# EasyEDA Pro project bldc_driver.eprj

# Schematic Schematic1

## Sheets
1 power_drivers: Board Name: Board1; Create Date: 2025-12-07; Page Name: power_drivers; Project Name: bldc_driver; Schematic Name: Schematic1; Update Date: 2025-12-07; Company: EasyEDA.com; Page Size: A4; Version: V1.0
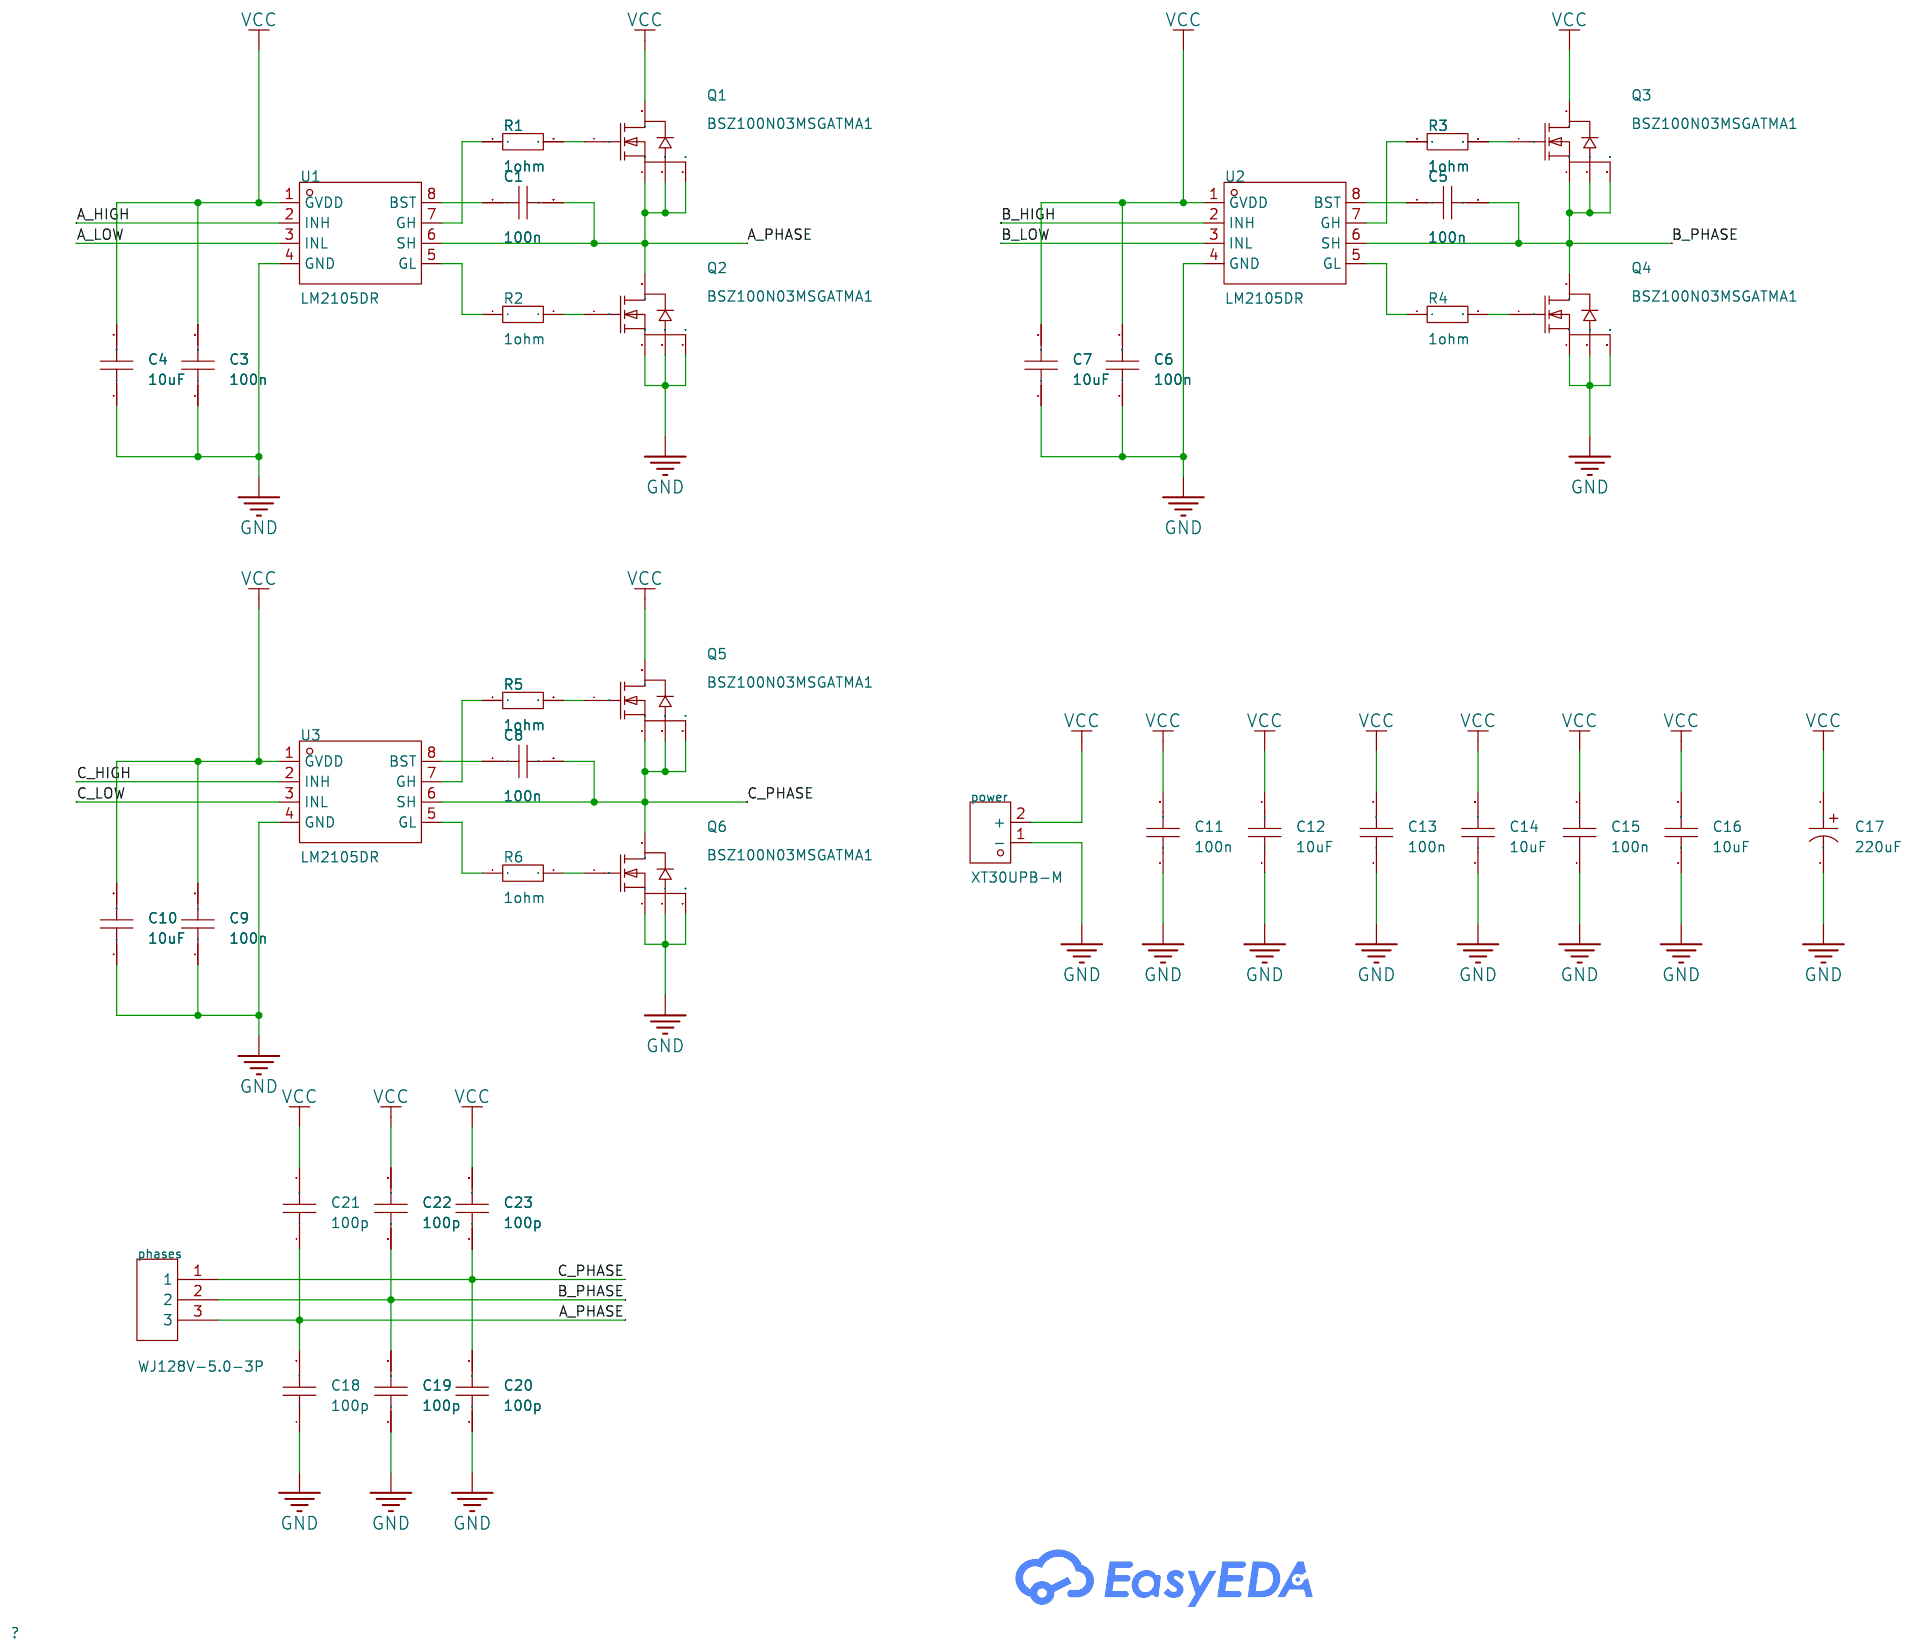
[diagram p0: power_drivers]
2 main: Page Name: main; Update Date: 2025-12-12
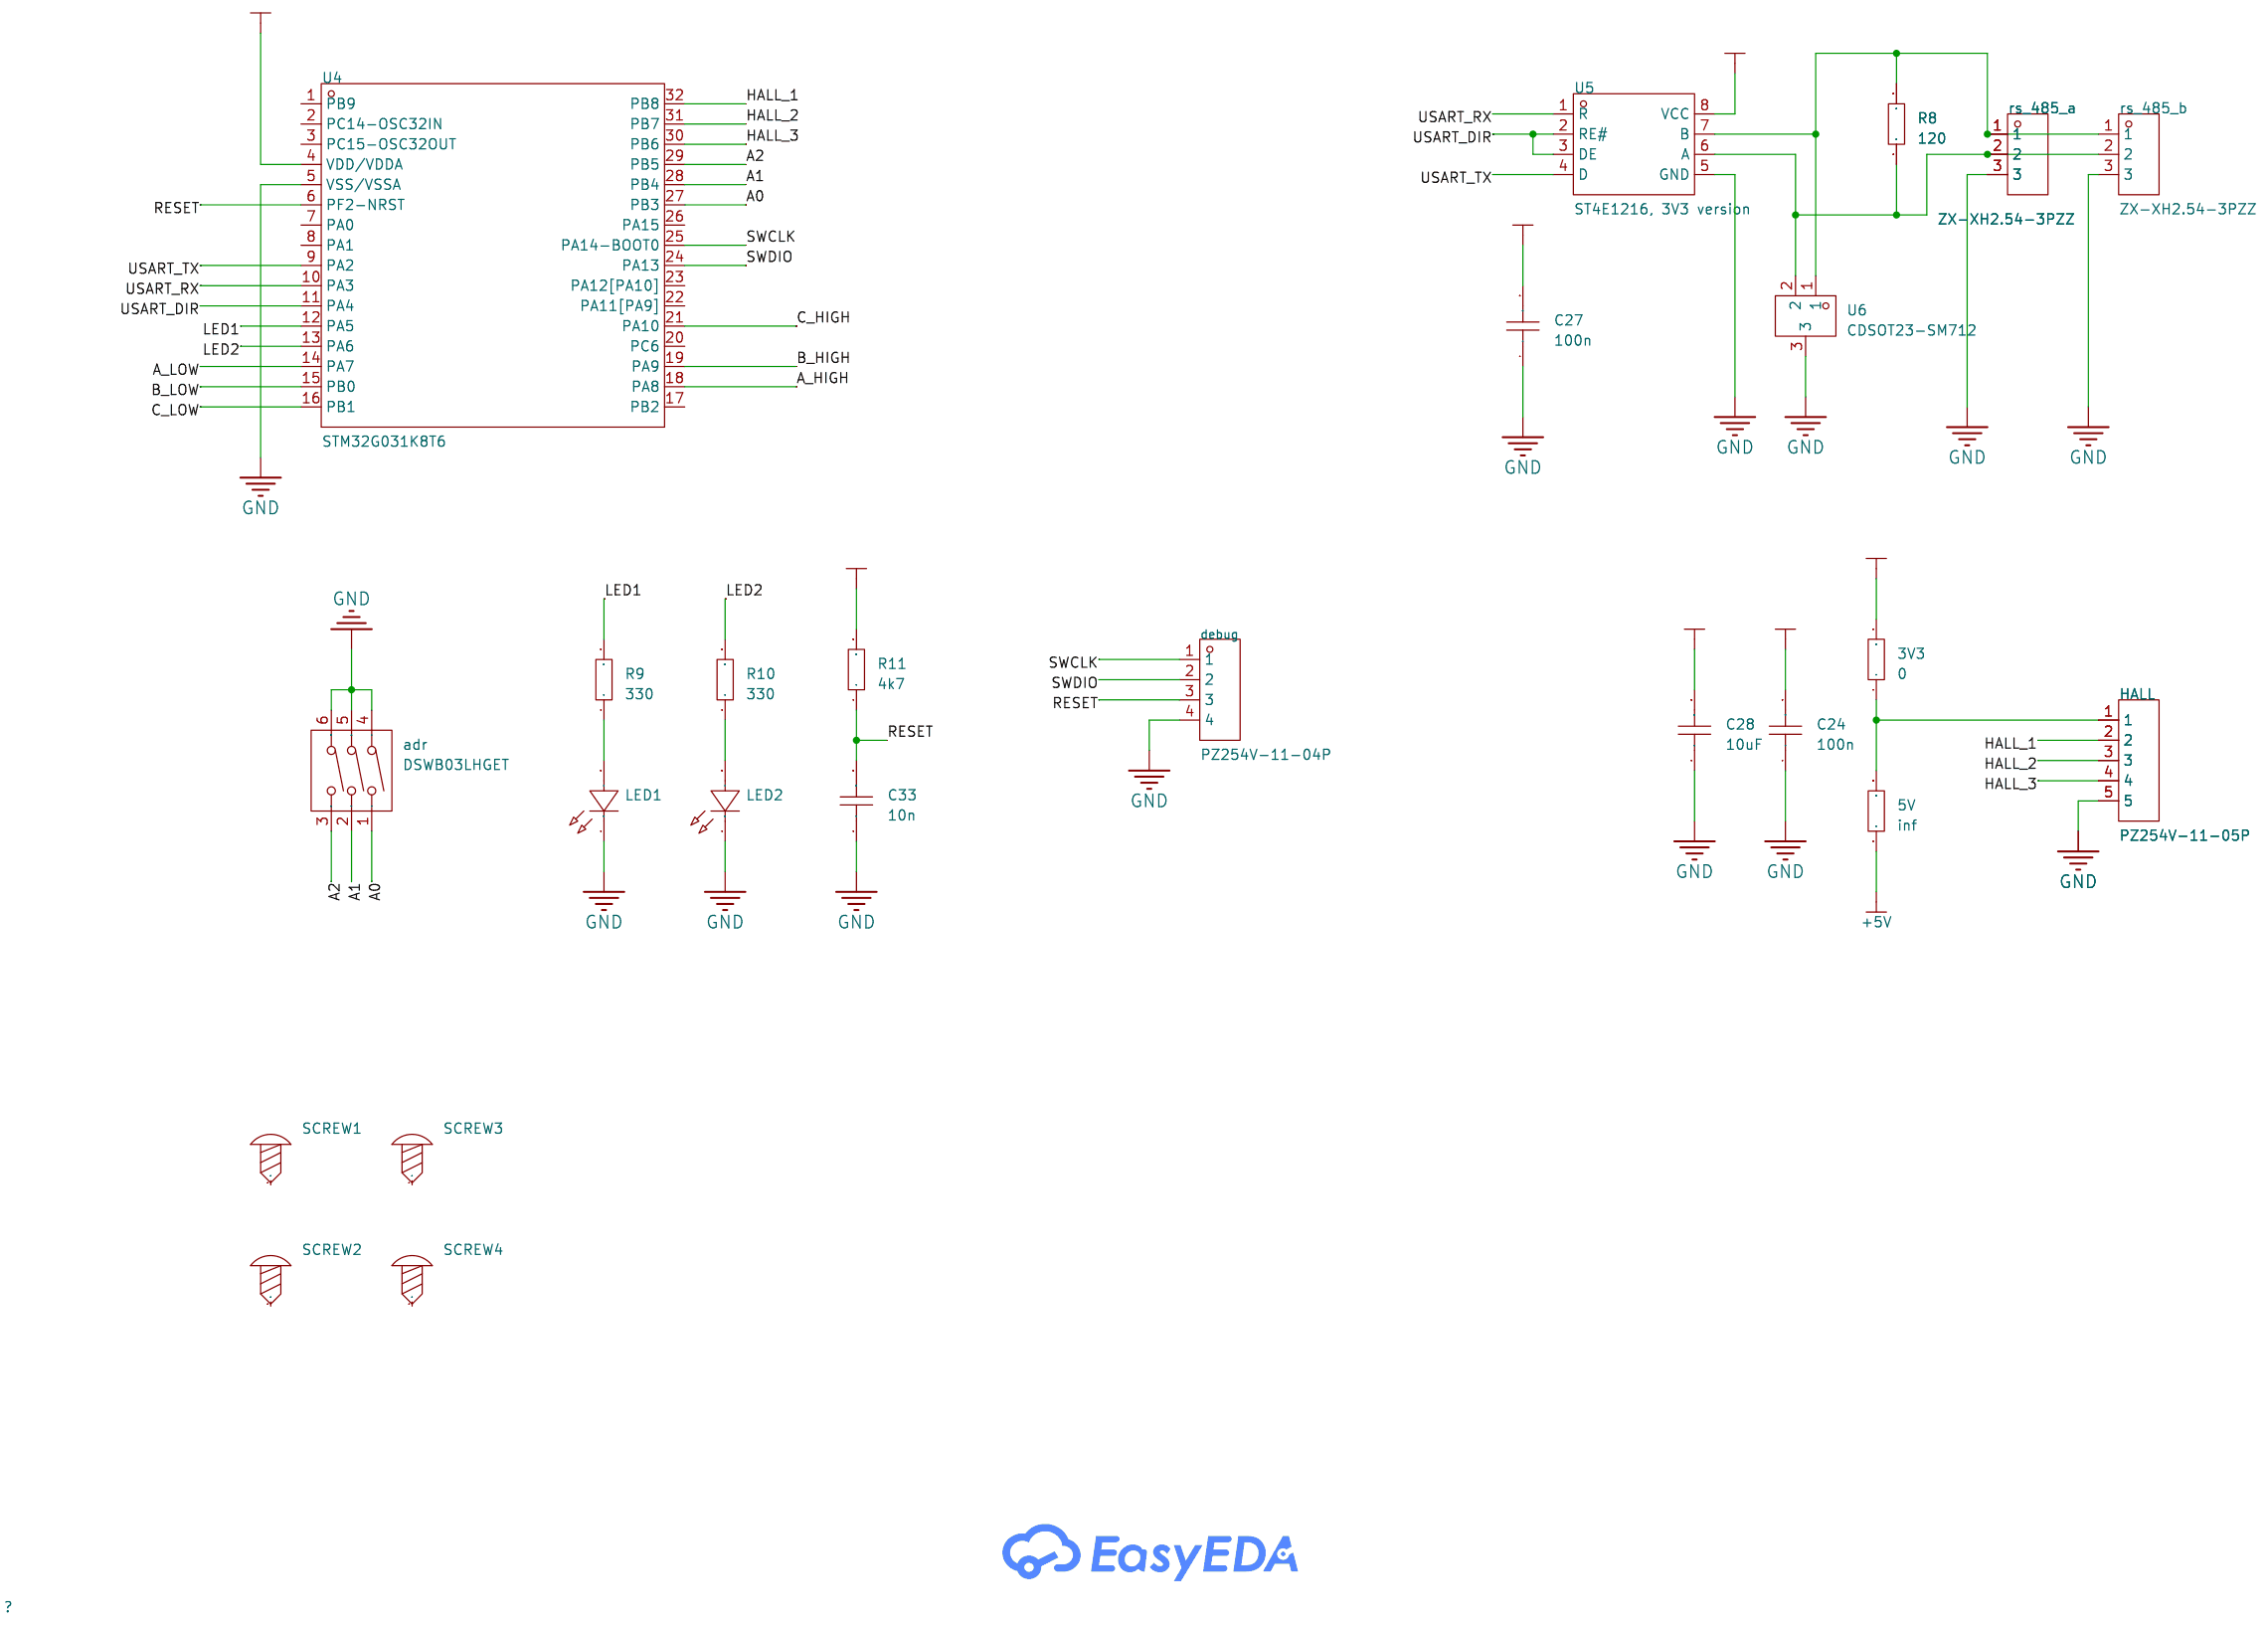
[diagram p1: main]
3 supply: Create Date: 2025-12-12; Page Name: supply; Update Date: 2025-12-12
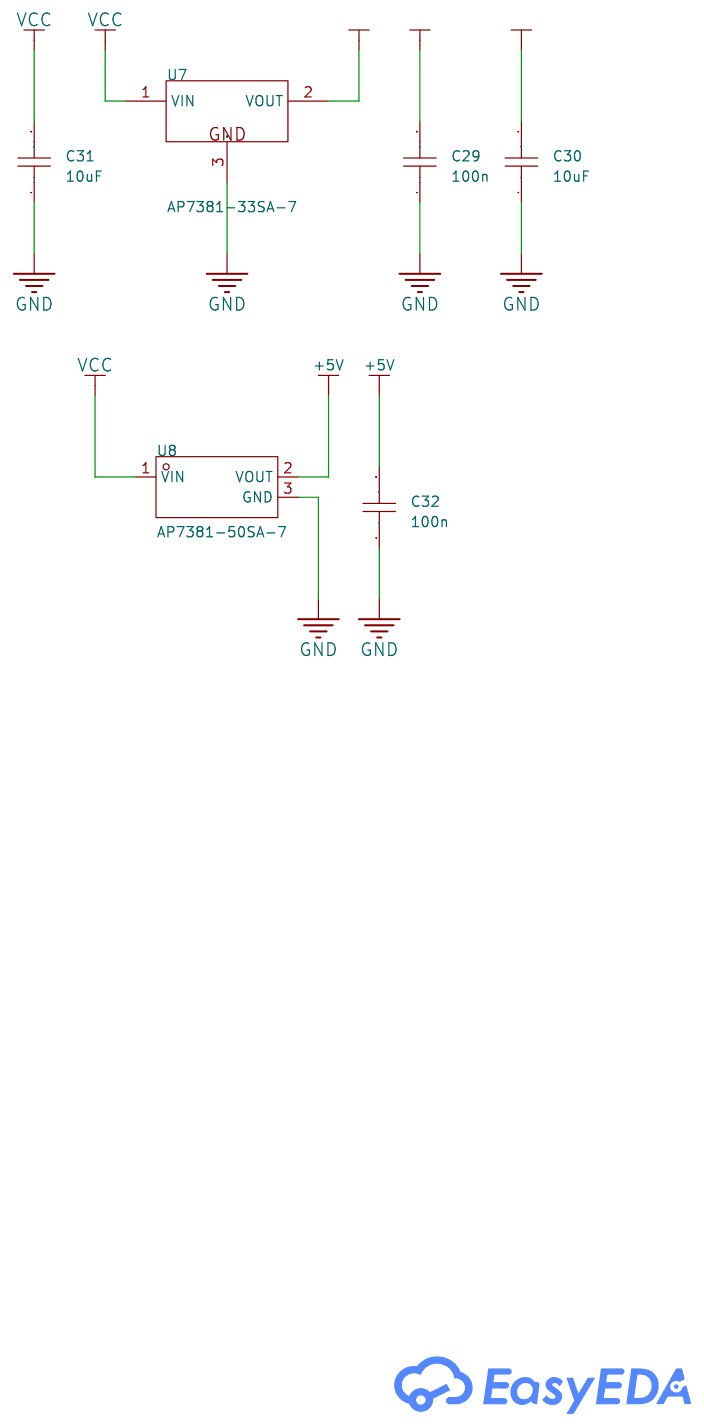
[diagram p2: supply]

## Parts
sheet main
3V3  10kΩ  [R0805]
5V  10kΩ  [R0805]
adr  DSWB03LHGET  [SW-TH_DSWB03LHGET]
C24  10uF  [C0805]
C27  10uF  [C0805]
C28  10uF  [C0805]
C33  10uF  [C0805]
debug  PZ254V-11-04P  [HDR-TH_4P-P2.54-V-M]
HALL  PZ254V-11-05P  [HDR-TH_5P-P2.54-V-M]
LED1  P2-1206RTCS2-0.9T-F  [LED-SMD_L3.2-W1.6-P2-1206RTCS2-0.9T-F]
LED2  P2-1206RTCS2-0.9T-F  [LED-SMD_L3.2-W1.6-P2-1206RTCS2-0.9T-F]
R8  10kΩ  [R0805]
R9  10kΩ  [R0805]
R10  10kΩ  [R0805]
R11  10kΩ  [R0805]
rs_485_a  ZX-XH2.54-3PZZ  [CONN-TH_3P-P2.54_2501S-3P]
rs_485_b  ZX-XH2.54-3PZZ  [CONN-TH_3P-P2.54_2501S-3P]
SCREW1  -  [Screw-Hole-M3]
SCREW2  -  [Screw-Hole-M3]
SCREW3  -  [Screw-Hole-M3]
SCREW4  -  [Screw-Hole-M3]
U4  STM32G031K8T6  [LQFP-32_L7.0-W7.0-P0.80-LS9.0-BL]
U5  ST4E1216, 3V3 version  [NSOIC-8_L4.9-W3.9-P1.27-LS6.1-BL]
U6  CDSOT23-SM712  [SOT-23-3_L2.9-W1.3-P0.95-LS2.4-BR]
sheet power_drivers
C1  10uF  [C0805]
C3  10uF  [C0805]
C4  10uF  [C0805]
C5  10uF  [C0805]
C6  10uF  [C0805]
C7  10uF  [C0805]
C8  10uF  [C0805]
C9  10uF  [C0805]
C10  10uF  [C0805]
C11  10uF  [C0805]
C12  10uF  [C0805]
C13  10uF  [C0805]
C14  10uF  [C0805]
C15  10uF  [C0805]
C16  10uF  [C0805]
C17  220uF  [CAP-SMD_BD10.0-L10.3-W10.3-LS10.9-FD]
C18  10uF  [C0805]
C19  10uF  [C0805]
C20  10uF  [C0805]
C21  10uF  [C0805]
C22  10uF  [C0805]
C23  10uF  [C0805]
phases  WJ128V-5.0-3P  [CONN-TH_3P-P5.00_WJ128V-5.0-3P]
power  XT30UPB-M  [CONN-TH_XT30UPB-M]
Q1  BSZ100N03MSGATMA1  [DFN-8_L3.3-W3.3-P0.65-BL-2]
Q2  BSZ100N03MSGATMA1  [DFN-8_L3.3-W3.3-P0.65-BL-2]
Q3  BSZ100N03MSGATMA1  [DFN-8_L3.3-W3.3-P0.65-BL-2]
Q4  BSZ100N03MSGATMA1  [DFN-8_L3.3-W3.3-P0.65-BL-2]
Q5  BSZ100N03MSGATMA1  [DFN-8_L3.3-W3.3-P0.65-BL-2]
Q6  BSZ100N03MSGATMA1  [DFN-8_L3.3-W3.3-P0.65-BL-2]
R1  10kΩ  [R0805]
R2  10kΩ  [R0805]
R3  10kΩ  [R0805]
R4  10kΩ  [R0805]
R5  10kΩ  [R0805]
R6  10kΩ  [R0805]
U1  LM2105DR  [SOIC-8_L4.9-W3.9-P1.27-LS6.0-BL]
U2  LM2105DR  [SOIC-8_L4.9-W3.9-P1.27-LS6.0-BL]
U3  LM2105DR  [SOIC-8_L4.9-W3.9-P1.27-LS6.0-BL]
sheet supply
C29  10uF  [C0805]
C30  10uF  [C0805]
C31  10uF  [C0805]
C32  10uF  [C0805]
U7  AP7381-33SA-7  [SOT-23-3_L2.9-W1.3-P1.90-LS2.4-BR]
U8  AP7381-50SA-7  [SOT-23-3_L2.9-W1.5-P1.90-LS2.6-BR]

## Library data of the parts
3V3 5V R1-R6 R8-R11 = 0805W8F1002T5E: LCSC Part Name: 10kΩ ±1% 125mW 厚膜电阻; Supplier Part: C17414; Manufacturer: UNI-ROYAL(厚声); Supplier Footprint: 0805; JLCPCB Part Class: Basic Part; Datasheet: https://item.szlcsc.com/datasheet/0805W8F1002T5E/18102.html; Supplier: LCSC; Type: Thick Film Resistor; Tolerance: ±1%; Power(Watts): 125mW; Voltage-Supply(Max): 150V; Temperature Coefficient: ±100ppm/℃; Operating Temperature: -55℃~+155℃
adr = DSWB03LHGET: LCSC Part Name: 间距2.54mm 平拨,凸起式 3位拨码开关; Supplier Part: C99420; Manufacturer: YE; Supplier Footprint: 插件; JLCPCB Part Class: Extended Part; Datasheet: https://item.szlcsc.com/datasheet/DSWB03LHGET/100634.html; Supplier: LCSC; Type: Slide, Rocked; Circuit: SPST; Number of Positions: 3; Lead Pitch: 2.54mm; Color: Red
C1 C3-C16 C18-C24 C27-C33 = CL21A106KAYNNNE_C15850: LCSC Part Name: 10uF ±10% 25V; Supplier Part: C15850; Manufacturer: SAMSUNG(三星); Manufacturer Part: CL21A106KAYNNNE; Supplier Footprint: 0805; JLCPCB Part Class: Basic Part; Datasheet: https://item.szlcsc.com/datasheet/CL21A106KAYNNNE/16532.html; Supplier: LCSC; Tolerance: ±10%; Voltage Rating: 25V; Temperature Coefficient: X5R
debug = PZ254V-11-04P: LCSC Part Name: 1x4P 间距:2.54mm 方针 直插; Supplier Part: C2691448; Manufacturer: XFCN(兴飞); Supplier Footprint: 插件,P=2.54mm; JLCPCB Part Class: Extended Part; Datasheet: https://item.szlcsc.com/datasheet/PZ254V-11-04P/2801085.html; Supplier: LCSC; Pin Structure: 1x4P; Pitch: 2.54mm; Circluar Pins/Square Pins: Pin Header; Mounting Type: Through Hole; Number of Rows: 1; Number of Pins: 4P; Current Rating: 3A; Voltage Rating (Max): 250V; Length of Mating Pin: 6mm; Insulation Height: 2.5mm; Length of End Connection Pin: 3mm; Operating Temperature: -40℃~+105℃; Color: Black
HALL = PZ254V-11-05P: LCSC Part Name: 1x5P 间距:2.54mm 方针 直插; Supplier Part: C492404; Manufacturer: XFCN(兴飞); Supplier Footprint: 插件,P=2.54mm; JLCPCB Part Class: Extended Part; Datasheet: https://item.szlcsc.com/datasheet/PZ254V-11-05P/502960.html; Supplier: LCSC; Pin Structure: 1x5P; Pitch: 2.54mm; Circluar Pins/Square Pins: Pin Header; Mounting Type: Through Hole; Number of Rows: 1; Number of Pins: 5P; Length of Mating Pin: 6mm; Insulation Height: 2.5mm; Length of End Connection Pin: 3mm; Contact Material: Brass; Operating Temperature: -40℃~+105℃; Color: Black
LED1 LED2 = P2-1206RTCS2-0.9T-F: LCSC Part Name: 红灯 反贴; Supplier Part: C2827254; Manufacturer: TUOZHAN(拓展光电); Supplier Footprint: 1206; JLCPCB Part Class: Extended Part; Datasheet: https://item.szlcsc.com/datasheet/P2-1206RTCS2-0.9T-F/2972467.html; Supplier: LCSC; Illumination Color: Red; Voltage - Forward(Vf): 1.8V~2.4V; Power(Watts): 60mW; Forward Current: 20mA; Wavelength - Dominant: 618nm~625nm; Peak Wavelength: 630nm; Lens Color: Water Clear; Luminous Intensity: 250mcd; Viewing Angle: 120°; Mounting Style: Reverse Mount; Operating Temperature: -40℃~+85℃
rs_485_a rs_485_b = ZX-XH2.54-3PZZ: LCSC Part Name: 1x3P 间距:2.5mm 直插 系列:XH; Supplier Part: C7429633; Manufacturer: Megastar(兆星); Supplier Footprint: 插件,P=2.5mm; JLCPCB Part Class: Extended Part; Datasheet: https://item.szlcsc.com/datasheet/ZX-XH2.54-3PZZ/8427550.html; Supplier: LCSC; Pins Structure: 1x3P; Pitch: 2.5mm; Mounting Type: Through Hole; Reference Series: XH; Number of Pins: 3P; Number of Rows: 1; Number of PINs Per Row: 3; Current Rating: 3A; Contact Material: Brass; Contact Plating: Tin; Operating Temperature: -25℃~+85℃; Voltage Rating: 250V; Plastic Material: PA66; Flame Retardant Rating: UL94V-0; Color: White; Z-Height of the Board: 7mm; X-Length of Bottom Edge on Board (Spacing Line): 10mm; Y-Width of Bottom Edge on Board: 5.9mm
SCREW1-SCREW4 = Screw-Hole-M3: Supplier Footprint: 插件
U4 = STM32G031K8T6: LCSC Part Name: 主流Arm Cortex-M0+ MCU，具有64 KB Flash存储器、8 KB RAM、64 MHz CPU、2x USART、定时器、ADC和通信接口，1.7-3.6V; Supplier Part: C432203; Manufacturer: ST(意法半导体); Supplier Footprint: LQFP-32(7x7); JLCPCB Part Class: Extended Part; Datasheet: https://item.szlcsc.com/datasheet/STM32G031K8T6/428991.html; Supplier: LCSC; CPU Core: ARM Cortex-M Series; CPU Maximum Speed: 64MHz; Program Storage Size: 64KB; Program Memory Type: FLASH; Number of I/O: 30; ADC (Bit): 12bit; Voltage - Supply: 1.7V~3.6V
U5 = THVD1510DR: LCSC Part Name: THVD15xx 5-V RS-485 收发器，带有±18-kV IEC ESD 保护; Supplier Part: C191012; Manufacturer: TI(德州仪器); Supplier Footprint: SOIC-8; JLCPCB Part Class: Extended Part; Datasheet: https://www.ti.com/cn/lit/gpn/thvd1510; Supplier: LCSC; Type: Transceiver; Number of Drivers: 1; Number of Receivers: 1; Voltage - Supply: 4.5V~5.5V; Data Rate: 500Kbps; Number of Nodes: 256; ESD Protect: ±30kV; Operating Temperature: -40℃~+125℃; Communication Mode: Half-Duplex
U6 = CDSOT23-SM712: Supplier Part: C5122012; Manufacturer: TECH PUBLIC(台舟); Supplier Footprint: SOT-23; JLCPCB Part Class: Extended Part; Datasheet: https://item.szlcsc.com/datasheet/CDSOT23-SM712/5710598.html; Supplier: LCSC; Polarity: Bidirectional; Reverse Stand-Off Voltage (Vrwm): 12V；7V; Clamping Voltage: 12V；26V; Peak Pulse Current (Ipp): 17A; Peak Pulse Power Dissipation (Ppp): 400W; Voltage - Breakdown: 7.5V；13.3V; Reverse Leakage Current (Ir): 50nA；2uA; Number of Channels: 2; Operating Temperature: -55℃~+125℃; level of protection: IEC 61000-4-2；IEC 61000-4-4；IEC 61000-4-5; Type: ESD
C17 = XT1E221M1010: LCSC Part Name: 220uF ±20% 25V; Supplier Part: C22396808; Manufacturer: JARSON(伽盛); Supplier Footprint: SMD,10.5x10mm; JLCPCB Part Class: Extended Part; Datasheet: https://item.szlcsc.com/datasheet/XT1E221M1010/24004344.html; Supplier: LCSC; Tolerance: ±20%; Voltage Rating: 25V; Diameter: 10.5mm; Height - Seated (Max): 10.5mm; Operating Temperature: -55℃~+105℃
phases = WJ128V-5.0-3P: LCSC Part Name: 5mm 1x3P 排数:1 每排P数:3 直插; Supplier Part: C8270; Manufacturer: KANGNEX(康奈克斯电气); Supplier Footprint: 插件,P=5mm; JLCPCB Part Class: Extended Part; Datasheet: https://item.szlcsc.com/datasheet/WJ128V-5.0-3P/8762.html; Supplier: LCSC; Number of Positions or Pins: 1x3P; Pitch: 5mm; Color: Green; Mounting Type: Through Hole; Number of Pins: 3P; Number of Rows: 1; Number of PINs Per Row: 3; Current Rating: 20A; Voltage Rating (Max): 250V; Wire Gauge - AWG: 12~22; Wire Gauge - mm2: 2.5; Operating Temperature: -40℃~+105℃
power = XT30UPB-M: LCSC Part Name: AMASS(艾迈斯)板载立式 航模锂电池控制器连接器插头 公头XT30UPB-M; Supplier Part: C428721; Manufacturer: AMASS(艾迈斯); JLCPCB Part Class: Extended Part; Datasheet: https://item.szlcsc.com/datasheet/XT30UPB-M/423831.html; Supplier: LCSC; Type: Aviation model plug; Colour: Yellow; RatedVoltage: DC 500V; InterfaceType: Male; MetalMaterial: Gold Plated; InsulationMaterial: PA; RatedCurrent: 15A; contact resistance: 0.65mΩ
Q1-Q6 = BSZ100N03MSGATMA1: LCSC Part Name: 1个N沟道 耐压:30V 电流:39A; Supplier Part: C3279284; Manufacturer: Infineon(英飞凌); Supplier Footprint: TSDSON-8; JLCPCB Part Class: Extended Part; Datasheet: https://item.szlcsc.com/datasheet/BSZ100N03MSGATMA1/3842182.html; Supplier: LCSC; Number: One N-channel; Drain to Source Voltage: 30V; Current - Continuous Drain(Id): 44A; RDS(on): 11.4mΩ@4.5V; Pd - Power Dissipation: 30W; Gate Threshold Voltage (Vgs(th)): 2V@250uA; Gate Charge(Qg): 23nC@10V; Input Capacitance(Ciss): 1.7nF; Reverse Transfer Capacitance (Crss@Vds): 27pF@15V; Operating Temperature: -55℃~+150℃; Type: N-Channel; Output Capacitance(Coss): 590pF
U1-U3 = LM2105DR: Supplier Part: C21316176; Manufacturer: TI(德州仪器); Supplier Footprint: SOIC-8; JLCPCB Part Class: Extended Part; Supplier: LCSC
U7 = AP7381-33SA-7: LCSC Part Name: 输入40V 输出3.3V 150mA; Supplier Part: C3752764; Manufacturer: DIODES(美台); Supplier Footprint: SOT-23; JLCPCB Part Class: Extended Part; Datasheet: https://item.szlcsc.com/datasheet/AP7381-33SA-7/4320291.html; Supplier: LCSC; Output Type: Fixed; Voltage - Supply: 40V; Output Voltage: 3.3V; Output Current: 150mA; Power Supply Rejection Ratio (PSRR): 60dB; Voltage Dropout: 1V@(100mA); standby current: 2.5uA; Features: Thermal Shutdown；Short Circuit Protection; Operating Temperature: -40℃~+125℃@(Tj); Output Configuration: Positive; Number of Outputs: 1
U8 = AP7381-50SA-7: LCSC Part Name: 宽输入电压范围150mA超低压降稳压器; Supplier Part: C5329419; Manufacturer: DIODES(美台); Supplier Footprint: SOT-23; JLCPCB Part Class: Extended Part; Datasheet: https://atta.szlcsc.com/upload/public/pdf/source/20221212/C640A29B38F82A6524DE1F66CB8A4A92.pdf; Supplier: LCSC; Output Type: Fixed; Maximum Input Voltage: 40V; Output Voltage: 5V; Output Current: 150mA; Feature: Low ESR；ESD Protection；Thermal Protection(TSD)；Overcurrent Protection(OCP)；Automotive Standard Certification; Operating Temperature: -40℃~+125℃@(Tj); Output Polarity: Positive electrode; Number of Outputs: 1

## Nets
+3V3: 3V3.2 C24.2 C27.2 C28.2 C29.2 C30.2 R11.2 U4.4(VDD/VDDA) U5.8(VCC) U7.2(VOUT)
+5V: 5V.1 C32.2 U8.2(VOUT)
GND: adr.4 adr.5 adr.6 C3.1 C4.1 C6.1 C7.1 C9.1 C10.1 C11.1 C12.1 C13.1 C14.1 C15.1 C16.1 C17.2 C18.1 C19.1 C20.1 C24.1 C27.1 C28.1 C29.1 C30.1 C31.1 C32.1 C33.1 debug.4 HALL.5 LED1.1(C) LED2.1(C) power.1(-) Q2.1(S) Q2.2(S) Q2.3(S) Q4.1(S) Q4.2(S) Q4.3(S) Q6.1(S) Q6.2(S) Q6.3(S) rs_485_a.3 rs_485_b.3 U1.4(GND) U2.4(GND) U3.4(GND) U4.5(VSS/VSSA) U5.5(GND) U6.3 U7.3(GND) U8.3(GND)
VCC: C3.2 C4.2 C6.2 C7.2 C9.2 C10.2 C11.2 C12.2 C13.2 C14.2 C15.2 C16.2 C17.1 C21.2 C22.2 C23.2 C31.2 power.2(+) Q1.5(D) Q3.5(D) Q5.5(D) U1.1(GVDD) U2.1(GVDD) U3.1(GVDD) U7.1(VIN) U8.1(VIN)
A0: adr.1 U4.27(PB3)
A1: adr.2 U4.28(PB4)
A2: adr.3 U4.29(PB5)
A_HIGH: U1.2(INH) U4.18(PA8)
A_LOW: U1.3(INL) U4.14(PA7)
A_PHASE: C1.2 C18.2 C21.1 phases.3 Q1.1(S) Q1.2(S) Q1.3(S) Q2.5(D) U1.6(SH)
B_HIGH: U2.2(INH) U4.19(PA9)
B_LOW: U2.3(INL) U4.15(PB0)
B_PHASE: C5.2 C19.2 C22.1 phases.2 Q3.1(S) Q3.2(S) Q3.3(S) Q4.5(D) U2.6(SH)
C_HIGH: U3.2(INH) U4.21(PA10)
C_LOW: U3.3(INL) U4.16(PB1)
C_PHASE: C8.2 C20.2 C23.1 phases.1 Q5.1(S) Q5.2(S) Q5.3(S) Q6.5(D) U3.6(SH)
HALL_1: HALL.2 U4.32(PB8)
HALL_2: HALL.3 U4.31(PB7)
HALL_3: HALL.4 U4.30(PB6)
LED1: R9.2 U4.12(PA5)
LED2: R10.2 U4.13(PA6)
RESET: C33.2 debug.3 R11.1 U4.6(PF2-NRST)
SWCLK: debug.1 U4.25(PA14-BOOT0)
SWDIO: debug.2 U4.24(PA13)
USART_DIR: U4.11(PA4) U5.2(RE#) U5.3(DE)
USART_RX: U4.10(PA3) U5.1(R)
USART_TX: U4.9(PA2) U5.4(D)
$1N604: R2.1 U1.5(GL)
$1N613: Q2.4(G) R2.2
$1N618: R1.1 U1.7(GH)
$1N628: Q1.4(G) R1.2
$1N817: C1.1 U1.8(BST)
$1N1991: R4.1 U2.5(GL)
$1N1995: Q4.4(G) R4.2
$1N1997: R3.1 U2.7(GH)
$1N2001: Q3.4(G) R3.2
$1N2003: C5.1 U2.8(BST)
$1N2429: R6.1 U3.5(GL)
$1N2433: Q6.4(G) R6.2
$1N2435: R5.1 U3.7(GH)
$1N2439: Q5.4(G) R5.2
$1N2441: C8.1 U3.8(BST)
$2N1083: R8.1 rs_485_a.2 rs_485_b.2 U5.6(A) U6.2
$2N1088: R8.2 rs_485_a.1 rs_485_b.1 U5.7(B) U6.1
$2N2150: LED1.2(A) R9.1
$2N2269: LED2.2(A) R10.1
$2N2761: 3V3.1 5V.2 HALL.1

Not connected (* = marked no-connect by the designer): SCREW1 1; SCREW2 1; SCREW3 1; SCREW4 1; U4 1(PB9) 2(PC14-OSC32IN) 3(PC15-OSC32OUT) 7(PA0) 8(PA1) 17(PB2) 20(PC6) 22(PA11[PA9]) 23(PA12[PA10]) 26(PA15)

# Board PCB1
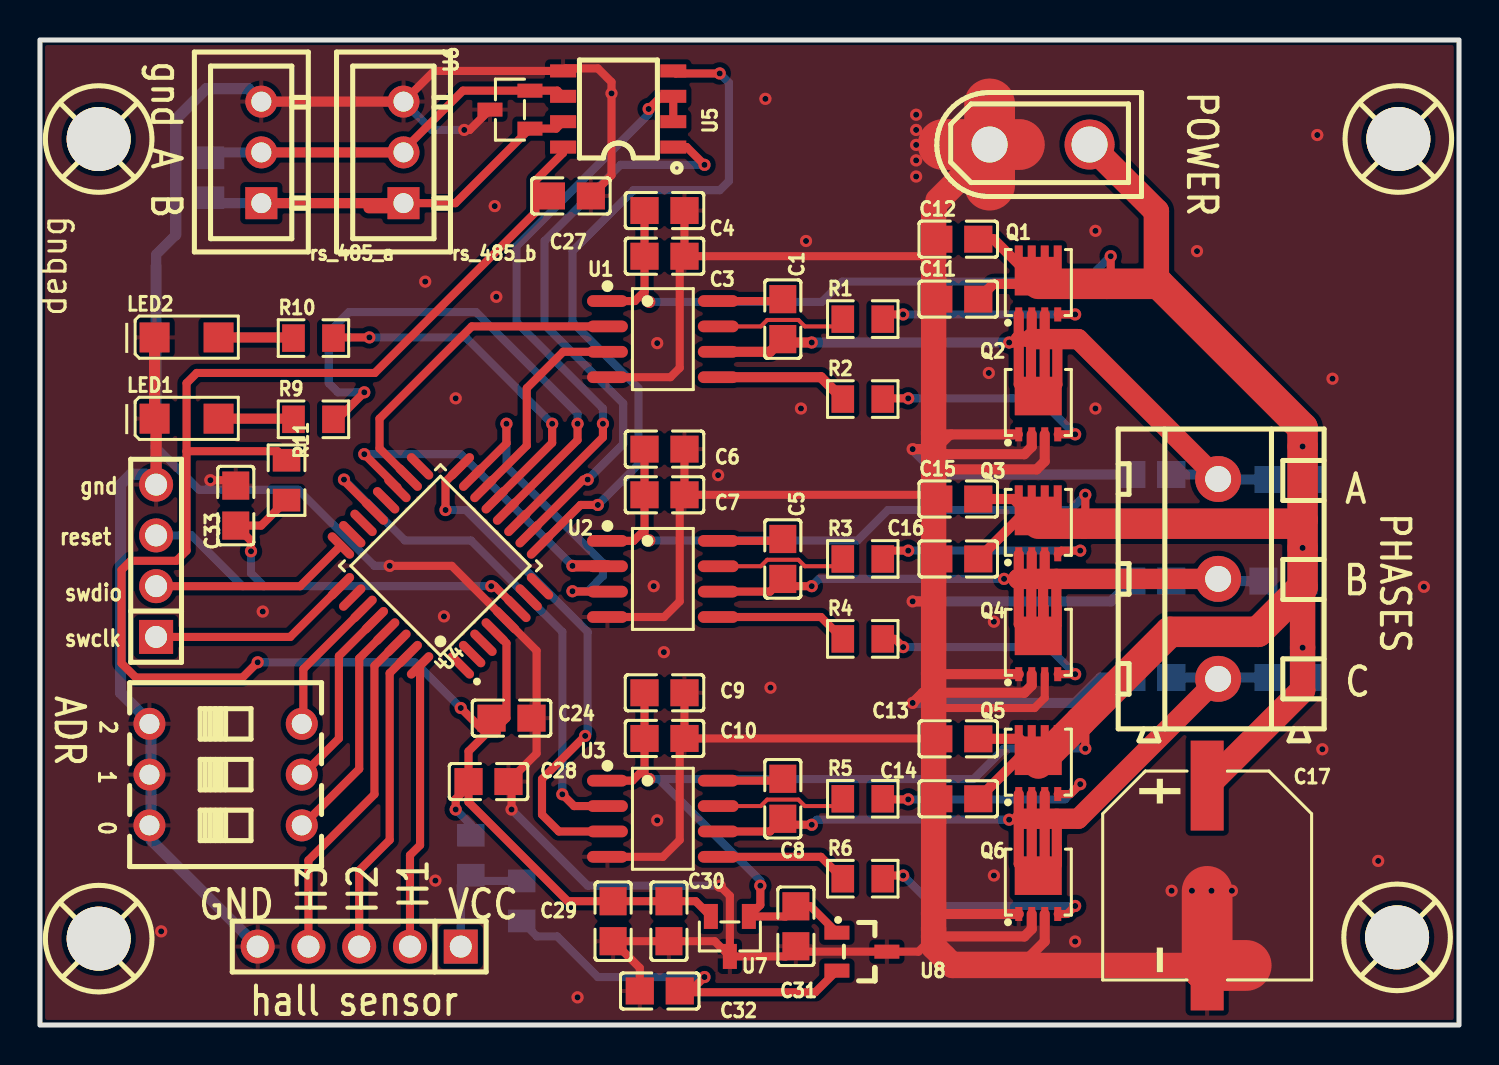
[diagram p3: board, top side]
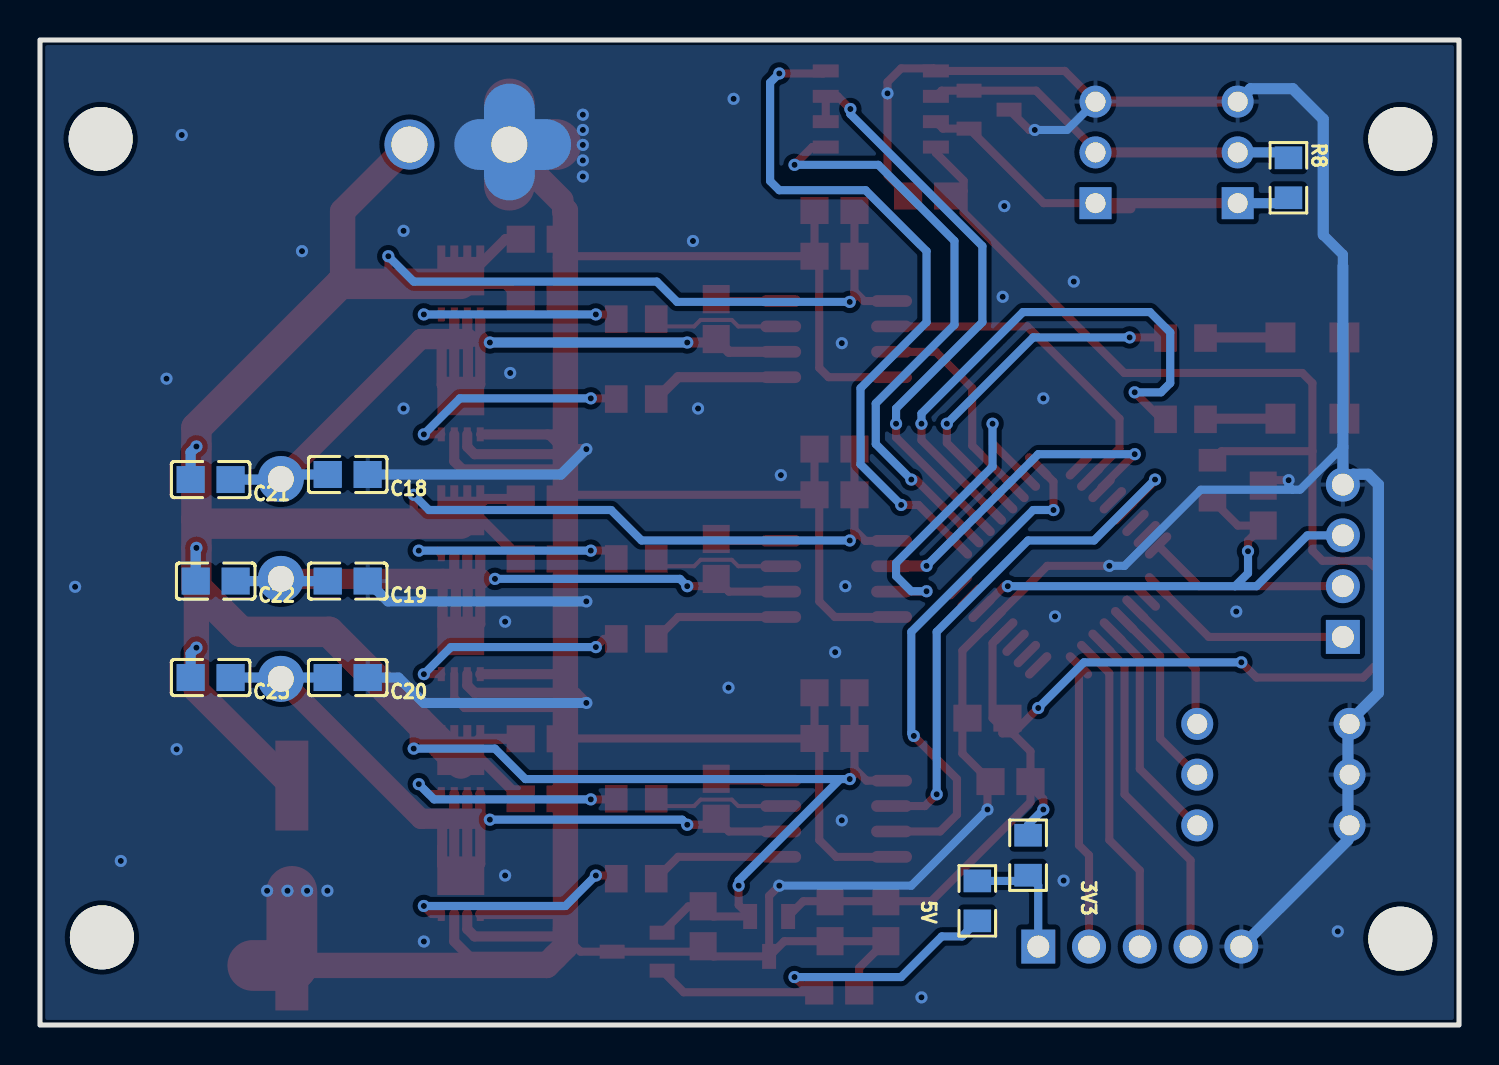
[diagram p4: board, bottom side, seen from below]

Outline 70.99 x 49.29 mm; copper layers: Top Layer, Bottom Layer. Coordinates in mm from the lower left corner of the outline.
Outline path: rectangle 0,49.29 70.99,0
Stack: Top Layer 0.035mm / Dielectric1 1.51mm FR4 er 4.5 / Bottom Layer 0.035mm

## Design rules (mm)
template: JLCPCB Capability(Two Layers Board)
spacing copperThickness1oz (default): track to track 0.102, other pairs 0.152 to 0.3
spacing copperThickness2oz: track to track 0.203, other pairs 0.152 to 0.3
track width copperThickness1oz (default): min 0.127, default 0.254, max 2.54
track width copperThickness2oz: min 0.203, default 0.254, max 2.54
differential pair differentialPair (default): width min 0.127, default 0.254, max 2.54; gap min 0.152, default 0.152
via viaSize (default): diameter min 0.5, default 0.61, max 10; hole min 0.3, default 0.305, max 6.3

## Placement (name value [footprint] x y rotation side)
3V3  10kΩ  [R0805]  21.56 8.5 90 bottom
5V  10kΩ  [R0805]  24.1 6.21 90 bottom
adr  DSWB03LHGET  [SW-TH_DSWB03LHGET]  9.29 12.53 270 top
C1  10uF  [C0805]  37.16 35.32 270 top
C3  10uF  [C0805]  31.24 38.47 180 top
C4  10uF  [C0805]  31.24 40.75 180 top
C5  10uF  [C0805]  37.16 23.32 270 top
C6  10uF  [C0805]  31.24 28.82 180 top
C7  10uF  [C0805]  31.24 26.53 180 top
C8  10uF  [C0805]  37.16 11.32 270 top
C9  10uF  [C0805]  31.24 16.62 180 top
C10  10uF  [C0805]  31.24 14.34 180 top
C11  10uF  [C0805]  45.94 36.32 0 top
C12  10uF  [C0805]  45.94 39.32 0 top
C13  10uF  [C0805]  45.94 14.32 0 top
C14  10uF  [C0805]  45.94 11.32 0 top
C15  10uF  [C0805]  45.94 26.32 0 top
C16  10uF  [C0805]  45.94 23.32 0 top
C17  220uF  [CAP-SMD_BD10.0-L10.3-W10.3-LS10.9-FD]  58.39 7.48 270 top
C18  10uF  [C0805]  55.59 27.55 0 bottom
C19  10uF  [C0805]  55.59 22.21 0 bottom
C20  10uF  [C0805]  55.59 17.39 0 bottom
C21  10uF  [C0805]  62.45 27.29 0 bottom
C22  10uF  [C0805]  62.2 22.21 0 bottom
C23  10uF  [C0805]  62.45 17.39 0 bottom
C24  10uF  [C0805]  23.59 15.36 180 top
C27  10uF  [C0805]  26.56 41.48 180 top
C28  10uF  [C0805]  22.44 12.18 180 top
C29  10uF  [C0805]  28.67 5.19 90 top
C30  10uF  [C0805]  31.46 5.19 90 top
C31  10uF  [C0805]  37.81 4.94 90 top
C32  10uF  [C0805]  31.01 1.7 0 top
C33  10uF  [C0805]  9.79 25.99 270 top
debug  PZ254V-11-04P  [HDR-TH_4P-P2.54-V-M]  5.81 23.23 90 top
HALL  PZ254V-11-05P  [HDR-TH_5P-P2.54-V-M]  15.97 3.92 180 top
LED1  P2-1206RTCS2-0.9T-F  [LED-SMD_L3.2-W1.6-P2-1206RTCS2-0.9T-F]  7.33 30.34 0 top
LED2  P2-1206RTCS2-0.9T-F  [LED-SMD_L3.2-W1.6-P2-1206RTCS2-0.9T-F]  7.33 34.41 0 top
phases  WJ128V-5.0-3P  [CONN-TH_3P-P5.00_WJ128V-5.0-3P]  58.94 22.32 90 top
power  XT30UPB-M  [CONN-TH_XT30UPB-M]  50.01 44.06 0 top
Q1  BSZ100N03MSGATMA1  [DFN-8_L3.3-W3.3-P0.65-BL-2]  49.94 36.32 0 top
Q2  BSZ100N03MSGATMA1  [DFN-8_L3.3-W3.3-P0.65-BL-2]  49.94 30.32 0 top
Q3  BSZ100N03MSGATMA1  [DFN-8_L3.3-W3.3-P0.65-BL-2]  49.94 24.32 0 top
Q4  BSZ100N03MSGATMA1  [DFN-8_L3.3-W3.3-P0.65-BL-2]  49.94 18.32 0 top
Q5  BSZ100N03MSGATMA1  [DFN-8_L3.3-W3.3-P0.65-BL-2]  49.94 12.32 0 top
Q6  BSZ100N03MSGATMA1  [DFN-8_L3.3-W3.3-P0.65-BL-2]  49.94 6.32 0 top
R1  10kΩ  [R0805]  41.16 35.32 0 top
R2  10kΩ  [R0805]  41.16 31.32 0 top
R3  10kΩ  [R0805]  41.16 23.32 0 top
R4  10kΩ  [R0805]  41.16 19.32 0 top
R5  10kΩ  [R0805]  41.16 11.32 0 top
R6  10kΩ  [R0805]  41.16 7.32 0 top
R8  10kΩ  [R0805]  8.53 42.39 270 bottom
R9  10kΩ  [R0805]  13.68 30.31 0 top
R10  10kΩ  [R0805]  13.68 34.37 0 top
R11  10kΩ  [R0805]  12.33 27.26 90 top
rs_485_a  ZX-XH2.54-3PZZ  [CONN-TH_3P-P2.54_2501S-3P]  11.07 43.66 90 top
rs_485_b  ZX-XH2.54-3PZZ  [CONN-TH_3P-P2.54_2501S-3P]  18.19 43.66 90 top
SCREW1  -  [Screw-Hole-M3]  3 4.26 0 top
SCREW2  -  [Screw-Hole-M3]  67.95 4.32 0 top
SCREW3  -  [Screw-Hole-M3]  3 44.27 0 top
SCREW4  -  [Screw-Hole-M3]  68.02 44.27 0 top
U1  LM2105DR  [SOIC-8_L4.9-W3.9-P1.27-LS6.0-BL]  31.16 34.32 270 top
U2  LM2105DR  [SOIC-8_L4.9-W3.9-P1.27-LS6.0-BL]  31.16 22.32 270 top
U3  LM2105DR  [SOIC-8_L4.9-W3.9-P1.27-LS6.0-BL]  31.16 10.32 270 top
U4  STM32G031K8T6  [LQFP-32_L7.0-W7.0-P0.80-LS9.0-BL]  20.03 22.97 45 top
U5  ST4E1216, 3V3 version  [NSOIC-8_L4.9-W3.9-P1.27-LS6.1-BL]  28.92 45.83 90 top
U6  CDSOT23-SM712  [SOT-23-3_L2.9-W1.3-P0.95-LS2.4-BR]  23.51 45.8 0 top
U7  AP7381-33SA-7  [SOT-23-3_L2.9-W1.3-P1.90-LS2.4-BR]  34.51 4.43 90 top
U8  AP7381-50SA-7  [SOT-23-3_L2.9-W1.5-P1.90-LS2.6-BR]  41.12 3.67 180 top

## Footprints (pads in the part's own frame, mm; a bottom-side part is the same pattern mirrored in y, then rotated)
C0805
  rect 1.41x1.35 smd: 1(-1,0) 2(1,0)
CAP-SMD_BD10.0-L10.3-W10.3-LS10.9-FD
  rect 4.5x1.65 smd: 1(-4.5,0) 2(4.5,0)
CONN-TH_3P-P2.54_2501S-3P
  rect 1.6x1.6 hole 1: 1(-2.54,0)
  round 1.6 hole 1: 2(0,0) 3(2.54,0)
CONN-TH_3P-P5.00_WJ128V-5.0-3P
  round 2.3 hole 1.3: 1(-5,0) 2(0.003,0) 3(5,0)
CONN-TH_XT30UPB-M
  round 2.5 hole 1.8: 1(-2.5,0) 2(2.5,0)
DFN-8_L3.3-W3.3-P0.65-BL-2
  rect 0.35x0.7 smd: 1(-0.975,-0.765) 2(-0.325,-0.765) 3(0.325,-0.765) 4(0.975,-0.765)
  custom 2.352x2.498 smd: 5(0,0.765)
HDR-TH_4P-P2.54-V-M
  rect 1.7x1.7 hole 1.1: 1(-3.81,0)
  round 1.7 hole 1.1: 2(-1.27,0) 3(1.27,0) 4(3.81,0)
HDR-TH_5P-P2.54-V-M
  rect 1.7x1.7 hole 1.1: 1(-5.08,0)
  round 1.7 hole 1.1: 2(-2.54,0) 3(0,0) 4(2.54,0) 5(5.08,0)
LED-SMD_L3.2-W1.6-P2-1206RTCS2-0.9T-F
  rect 1.5x1.5 smd: 1(-1.6,0) 2(1.6,0)
LQFP-32_L7.0-W7.0-P0.80-LS9.0-BL
  oval 0.448x1.684 smd: 1(-2.8,-4.242) 2(-2,-4.242) 3(-1.2,-4.242) 4(-0.4,-4.242) 5(0.4,-4.242) 6(1.2,-4.242) 7(2,-4.242) 8(2.8,-4.242) 17(2.8,4.242) 18(2,4.242) 19(1.2,4.242) 20(0.4,4.242) 21(-0.4,4.242) 22(-1.2,4.242) 23(-2,4.242) 24(-2.8,4.242)
  oval 1.684x0.448 smd: 9(4.242,-2.8) 10(4.242,-2) 11(4.242,-1.2) 12(4.242,-0.4) 13(4.242,0.4) 14(4.242,1.2) 15(4.242,2) 16(4.242,2.8) 25(-4.242,2.8) 26(-4.242,2) 27(-4.242,1.2) 28(-4.242,0.4) 29(-4.242,-0.4) 30(-4.242,-1.2) 31(-4.242,-2) 32(-4.242,-2.8)
NSOIC-8_L4.9-W3.9-P1.27-LS6.1-BL
  rect 0.65x1.3 smd: 1(-1.905,-2.756) 2(-0.635,-2.756) 3(0.635,-2.756) 4(1.905,-2.756) 5(1.905,2.756) 6(0.635,2.756) 7(-0.635,2.756) 8(-1.905,2.756)
R0805
  rect 1.133x1.377 smd: 1(-1,0) 2(1,0)
Screw-Hole-M3
  round 3.2 hole 3.2: 1(-0.064,0.064)
SOIC-8_L4.9-W3.9-P1.27-LS6.0-BL
  oval 0.588x2.045 smd: 1(-1.905,-2.772) 2(-0.635,-2.772) 3(0.635,-2.772) 4(1.905,-2.772) 5(1.905,2.772) 6(0.635,2.772) 7(-0.635,2.772) 8(-1.905,2.772)
SOT-23-3_L2.9-W1.3-P0.95-LS2.4-BR
  rect 1.25x0.7 smd: 1(1,-0.95) 2(1,0.95) 3(-1,0)
SOT-23-3_L2.9-W1.3-P1.90-LS2.4-BR
  rect 1.25x0.7 smd: 1(1,-0.95) 2(1,0.95) 3(-1,0)
SOT-23-3_L2.9-W1.5-P1.90-LS2.6-BR
  rect 1.25x0.7 smd: 1(1.25,-0.95) 2(1.25,0.95) 3(-1.25,0)
SW-TH_DSWB03LHGET
  round 1.6 hole 1: 1(-2.54,3.81) 2(0,3.81) 3(2.54,3.81) 4(-2.54,-3.81) 5(0,-3.81) 6(2.54,-3.81)

## Nets
As in the schematic.

Pads without a net: SCREW1 1; SCREW2 1; SCREW3 1; SCREW4 1; U4 1 2 3 7 8 17 20 22 23 26

## Via types
v1: diameter 0.61, hole 0.305, Top Layer to Bottom Layer, 100 vias

## Routing (per net, layer and track width the routed paths; a pad name or vN(x,y) marks a point on that pad's centre or on a via; arc(x,y) is an arc through that point)
+3V3: length 96.1
  Top Layer w0.406: U4.4 23.34,19.11 23.34,15.36 22.84,14.86 22.84,14.59 22.34,14.59 ; 21.44,11.95 20.8,11.31 v1(20.8,10.78) ; 21.44,11.95 21.44,11.16 26.4,6.19 C29.2 C30.2 32.8,6.19 U7.2 ; 21.44,11.95 C28.2 21.44,13.7 22.34,14.59 ; 24.78,41.73 24.78,42.25 26.17,43.63 U5.8 ; 24.78,41.73 25.31,41.73 C27.2 ; 24.78,41.73 24.78,40.66 16.75,32.63 7.84,32.63 7.33,32.12 7.33,28.71 ; v1(10.89,18.15) 10.13,17.39 4.79,17.39 4.08,18.1 4.08,22.77 4.54,23.23 6.83,23.23 7.33,23.74 7.33,28.71 ; v1(21.05,15.86) 22.32,14.59 22.34,14.59 ; 7.33,28.71 11.88,28.71 R11.2 ; 22.34,14.59 22.84,15.1
  Bottom Layer w0.406: v1(21.05,15.86) 18.76,18.15 v1(10.89,18.15) ; 3V3.2 21.56,10.02 v1(20.8,10.78)
+5V: length 20.2
  Top Layer w0.406: v1(33.24,2.4) 32.54,1.7 C32.2 32.07,1.64 38.78,1.64 U8.2
  Bottom Layer w0.406: 5V.1 24.1,5.19 24.86,4.43 25.88,4.43 27.91,2.4 v1(33.24,2.4)
GND: length 397.6
  Top Layer w0.406: U7.3 37.31,3.43 C31.1 38.08,3.67 U8.3 43.94,3.67 44.7,4.43 ; U7.3 33.75,4.19 C30.1 C29.1 30.01,2.86 C32.1 ; U7.3 34.51,6.47 v1(34,6.97) ; 18.19,46.2 19.72,47.74 U5.5 26.29,47.87 27.91,47.87 28.59,47.18 v1(28.59,46.62) 28.59,42.52 C27.1 ; 44.7,14.29 44.65,14.34 C10.1 ; 44.7,38.4 44.63,38.47 C3.1 ; Q2.1 48.96,29.55 48.72,29.55 ; C7.1 C6.1 ; C7.1 32,26.29 32,21.2 31.22,20.42 U2.4 ; C7.1 44.62,26.53 44.7,26.61 ; U1.4 31.54,32.42 32,32.88 32,38.23 C3.1 ; 24.84,15.61 24.84,18.73 U4.5 20.6,22.97 v1(17.49,22.97) ; v1(21.22,44.79) 21.49,44.79 U6.3 ; 44.95,15.86 44.73,15.86 44.7,15.84 ; 44.95,15.86 49.75,15.86 50.26,16.37 Q4.3 ; 44.95,15.86 44.7,16.11 ; 45.32,28.56 44.7,27.95 ; 44.97,27.8 44.7,27.54 ; 24.84,15.1 24.84,13.59 C28.1 23.59,12.03 v1(23.59,10.78) ; C3.1 C4.1 ; U3.4 31.16,8.42 32,9.26 32,14.1 C10.1 ; 44.7,28.66 44.85,28.8 45.6,29.55 ; v1(8.52,27.26) 9.52,27.26 C33.1 ; C10.1 C9.1
  Top Layer w0.508: 44.7,27.95 44.85,27.8 49.86,27.8 50.26,28.21 Q2.3 ; Q2.2 49.61,28.93 49.24,28.56 45.09,28.56 ; 44.83,16.62 44.16,16.62 v1(43.66,16.12) ; 44.83,16.62 49.24,16.62 49.61,16.99 Q4.2 ; 44.83,16.62 44.7,16.75 ; 44.7,5.6 44.75,5.56 Q6.1 ; 44.7,29.63 44.78,29.55 48.72,29.55 ; v1(43.66,21.2) 44.66,21.2 44.7,21.15 ; Q4.1 44.75,17.56 44.7,17.6 ; 11.07,46.2 18.19,46.2 ; Q6.3 50.26,4.18 49.5,3.42 45.21,3.42 ; 44.7,4.8 45.07,4.43 49.24,4.43 49.61,4.8 Q6.2 ; 45.09,28.56 44.8,28.56 44.54,28.82 v1(43.66,28.82) ; 45.09,28.56 44.85,28.8
  Top Layer w0.559: debug.4 5.81,30.27 LED1.1 LED2.1
  Top Layer w1.27: C17.2 45.65,2.98 45.21,3.42 44.7,3.92 44.7,40.74 44.74,40.7 ; 44.93,41.26 47.51,43.84
  Top Layer w2.54: 60.34,2.98 C17.2 58.39,6.69 ; power.1 45.18,44.06 ; power.1 47.51,42.02 ; power.1 48.99,44.06 ; power.1 47.51,46.09
  Bottom Layer w0.406: v1(17.49,22.97) 16.73,22.97 12.92,26.78 8.33,26.78 ; 8.33,26.78 7.95,26.78 5.81,28.93 ; 8.33,26.78 8.52,26.98 v1(8.52,27.26) ; v1(21.22,44.79) 19.6,44.79 18.19,46.2 ; v1(34,6.97) 27.4,6.97 v1(23.59,10.78)
  Bottom Layer w0.508: v1(43.66,21.2) 53.58,21.2 C19.1 ; C18.1 44.93,27.55 v1(43.66,28.82) ; v1(43.66,16.12) 51.78,16.12 53.05,17.39 C20.1 ; 6.79,39.53 5.81,38.55 5.81,37.96
  Bottom Layer w0.559: 6.79,39.53 6.79,45.33 8.32,46.85 10.43,46.85 11.07,46.2 ; 5.81,37.96 debug.4 5.29,27.56 4.55,27.56 4.03,27.04 4.03,16.62 5.56,15.1 5.56,9.26 HALL.5
  Bottom Layer w2.54: power.1 45.69,44.06 ; power.1 47.51,45.83 ; power.1 48.99,44.06 ; power.1 47.51,42.53
  vias: v1(6.06,4.69) v1(11.14,20.69) v1(19.27,37.2) v1(19.78,7.23) v1(20.21,20.45) v1(20.8,31.36) v1(22.75,40.98) v1(22.83,36.44) v1(26.89,1.38) v1(30.7,21.96) v1(30.88,34.12) v1(30.88,10.24) v1(31.21,18.66) v1(33.92,27.52) v1(36.29,46.34) v1(36.54,16.88) v1(38.07,30.85) v1(38.32,39.23) v1(43.83,45.55) v1(43.83,44.79) v1(43.83,44.04) v1(43.83,43.26) v1(43.83,42.46) v1(47.47,32.63) v1(47.72,20.18) v1(47.72,7.48) v1(51.78,4.18) v1(52.8,39.74) v1(52.8,30.85) v1(56.61,6.72) v1(57.63,6.72) v1(57.88,38.72) v1(58.61,6.72) v1(59.63,6.72) v1(63.9,44.53) v1(64.15,13.8) v1(64.66,32.34) v1(66.94,8.21) v1(69.23,21.93)
VCC: length 208.5
  Top Layer w0.406: 52.06,15.21 52.29,14.97 v1(52.29,13.83) ; 30.24,24.77 29.7,24.23 U2.1 ; 30.24,24.77 C7.2 C6.2 ; 30.24,24.77 30.24,24.48 v1(30.48,24.25) ; C4.2 C3.2 30.24,36.71 ; v1(52.29,26.53) 52.29,25.14 52.24,25.09 ; 53.37,37.09 53.56,37.28 v1(53.56,38.47) ; U3.1 29.64,12.23 30.24,12.83 ; U8.1 38.55,5.94 C31.2 37.31,5.43 35.46,5.43 36.04,6.01 v1(36.04,6.97) ; 30.24,12.83 30.24,12.55 v1(30.48,12.31) ; 30.24,12.83 C10.2 C9.2 ; v1(30.48,36.18) 30.24,36.42 30.24,36.71 ; 30.24,36.71 29.76,36.23 U1.1
  Top Layer w0.508: C14.2 49.05,13.43 49.89,13.43 ; C11.2 47.7,37.09 Q1.5 47.7,39.32 C12.2 ; C15.2 48.7,26.32 49.51,25.52 49.13,25.52 C16.2 ; 49.89,13.43 49,14.32 C13.2 ; 49.89,13.43 50.28,13.43
  Top Layer w1.27: 55.85,37.45 55.85,40.72 power.2 ; C17.1 63.16,16.75 v1(63.16,18.88) 63.16,21.91
  Top Layer w1.524: Q5.5 56.53,19.67 60.93,19.67 63.16,21.91 v1(63.16,23.88) 63.16,25.29 ; 63.16,25.29 v1(63.16,28.95) 63.16,29.88 55.96,37.09 Q1.5 ; 63.16,25.29 62.96,25.09 Q3.5
  Bottom Layer w0.406: v1(53.56,38.47) 52.29,37.2 40.13,37.2 39.12,36.18 v1(30.48,36.18) ; v1(52.29,26.53) 51.53,25.77 42.42,25.77 40.89,24.25 v1(30.48,24.25) ; 30.96,12.31 46.7,12.31 48.23,13.83 v1(52.29,13.83) ; 30.96,12.31 v1(30.48,12.31) ; 30.96,12.31 36.04,7.23 v1(36.04,6.97)
  Bottom Layer w0.508: v1(63.16,18.88) 63.45,18.59 C23.2 ; C21.2 63.45,28.66 v1(63.16,28.95) ; v1(63.16,23.88) 63.2,23.84 C22.2
A0: length 7
  Top Layer w0.406: 16.19,20.82 13.18,17.81 13.18,15.1
A1: length 9.2
  Top Layer w0.406: 13.18,12.56 14.95,14.34 14.95,18.46 U4.28
A2: length 11.4
  Top Layer w0.406: U4.29 15.97,18.34 15.97,12.81 13.18,10.02
A_HIGH: length 16.9
  Top Layer w0.406: U1.2 21.6,34.96 16.99,30.34 16.99,28.85 U4.18
A_LOW: length 10.7
  Top Layer w0.406: U1.3 26.17,33.69 24.35,31.86 24.35,28.99 U4.14
A_PHASE: length 50.3
  Top Layer w0.508: Q1.2 49.61,34.36 49.58,34.32 49.58,31.45 ; 50.89,34.32 50.89,32.04 50.26,31.41 ; 49.58,31.45 Q2.5 50.26,31.41 ; 49.58,31.45 48.96,32.06 48.96,34.32 ; Q1.1 48.96,34.35 ; 48.96,34.35 48.94,34.32 ; 48.96,34.35 48.96,34.32 ; 50.26,31.41 50.26,34.44 ; v1(38.61,34.15) 37.33,34.15 C1.2 36.53,33.69 U1.6 ; 50.26,34.44 50.38,34.32 ; 50.26,34.44 Q1.3 ; 48.96,34.32 48.79,34.15 v1(48.48,34.15)
  Top Layer w0.762: 48.94,34.32 49.58,34.32
  Top Layer w1.016: phases.3 51.94,34.32 49.65,34.32 49.61,34.36
  Bottom Layer w0.508: C18.2 58.71,27.55 58.97,27.29 C21.1 ; v1(48.48,34.15) v1(38.61,34.15)
B_HIGH: length 16.9
  Top Layer w0.406: U4.19 17.88,26.9 v1(16.22,28.56)
  Top Layer w0.559: U2.2 28.37,22.97 v1(26.64,22.97)
  Bottom Layer w0.406: v1(26.64,22.97) 21.05,28.56 v1(16.22,28.56)
B_LOW: length 16.6
  Top Layer w0.406: U2.3 26.66,21.69 v1(26.64,21.7) ; v1(23.34,30.09) 23.34,29.11 U4.15
  Bottom Layer w0.406: v1(23.34,30.09) 23.34,27.94 28.16,23.12 28.16,22.47 27.4,21.7 v1(26.64,21.7)
B_PHASE: length 47.2
  Top Layer w0.406: 48.94,22.32 v1(48.23,22.32) ; U2.6 36.53,21.69 C5.2 37.52,21.96 v1(38.61,21.96)
  Top Layer w0.508: 49.59,19.43 49.59,22.32 49.61,22.35 Q3.2 ; 49.59,19.43 Q4.5 50.18,19.33 ; 49.59,19.43 48.96,20.06 Q3.1 ; 50.18,19.33 50.84,19.99 50.84,22.32 ; 50.18,19.33 50.18,22.32 50.26,22.41 Q3.3
  Top Layer w1.016: 48.94,22.32 48.94,22.32 phases.2
  Bottom Layer w0.406: v1(48.23,22.32) 38.97,22.32 v1(38.61,21.96)
  Bottom Layer w0.508: C22.1 58.83,22.21 ; 58.83,22.21 C19.2 ; 58.83,22.21 phases.2
C_HIGH: length 26.9
  Top Layer w0.406: U4.21 15.21,27.23 v1(15.21,27.29) ; v1(26.13,11.55) 26.72,10.96 U3.2
  Bottom Layer w0.406: v1(26.13,11.55) 26.13,19.67 21.56,24.25 18.26,24.25 v1(15.21,27.29)
C_LOW: length 25.9
  Top Layer w0.406: 21.05,27.95 20.29,27.19 v1(20.29,25.77) ; U3.3 25.96,9.69 25.11,10.53 25.11,12.31 v1(27.27,14.47)
  Bottom Layer w0.406: v1(20.29,25.77) 21.3,25.77 27.4,19.67 27.4,14.59 v1(27.27,14.47)
C_PHASE: length 50.4
  Top Layer w0.406: v1(38.61,10.02) 37.46,10.02 C8.2 36.53,9.69 U3.6 ; 48.96,10.32 48.92,10.27 v1(48.48,10.27)
  Top Layer w0.508: 49.61,7.41 49.61,10.41 ; 49.61,7.41 Q6.5 50.26,7.41 ; 49.61,7.41 48.96,8.06 Q5.1 ; 50.87,10.32 50.87,8.02 50.26,7.41 ; 50.26,10.4 50.18,10.32 ; 50.26,10.4 Q5.3 ; 50.26,10.4 50.26,7.41 ; 49.61,10.41 Q5.2 ; 49.61,10.41 49.52,10.32
  Top Layer w0.762: 48.96,10.32 49.18,10.32
  Top Layer w1.016: phases.1 51.94,10.32 49.18,10.32
  Bottom Layer w0.406: v1(48.48,10.27) 38.86,10.27 v1(38.61,10.02)
  Bottom Layer w0.508: C20.2 58.87,17.39 phases.1 59,17.39 C23.1
HALL_1: length 14.3
  Top Layer w0.406: U4.32 19.01,9 18.51,8.5 HALL.2
HALL_2: length 15.7
  Top Layer w0.406: HALL.3 15.97,7.73 17.49,9.26 17.49,17.61 U4.31
HALL_3: length 17
  Top Layer w0.406: U4.30 16.73,17.98 16.73,11.55 13.43,8.24 HALL.4
LED1: length 28
  Top Layer w0.406: U4.12 26.89,29.27 v1(26.89,30.09) ; R9.2 14.87,30.31 v1(16.22,31.66)
  Bottom Layer w0.406: v1(16.22,31.66) 14.91,31.66 14.45,32.12 14.45,34.66 15.46,35.67 21.81,35.67 26.89,30.59 v1(26.89,30.09)
LED2: length 17.8
  Top Layer w0.406: R10.2 14.71,34.41 v1(16.48,34.41) ; U4.13 25.62,29.13 v1(25.62,30.09)
  Bottom Layer w0.406: v1(25.62,30.09) 21.3,34.41 v1(16.48,34.41)
RESET: length 26.3
  Top Layer w0.406: R11.1 11.06,24.99 C33.2 10.56,24.23 v1(10.56,23.7) ; v1(22.57,21.96) 22.75,21.96 23.88,20.82
  Bottom Layer w0.406: 11.2,21.96 10.13,21.96 7.59,24.5 debug.3 ; 11.2,21.96 10.56,22.6 v1(10.56,23.7) ; 11.2,21.96 v1(22.57,21.96)
SWCLK: length 10.3
  Top Layer w0.406: debug.1 12.52,19.42 U4.25
SWDIO: length 10.1
  Top Layer w0.406: U4.24 13.02,21.96 debug.2
USART_DIR: length 29.8
  Top Layer w0.406: 23.88,25.13 28.16,29.41 v1(28.16,30.09) ; 31.68,45.2 U5.3 31.08,46.47 v1(30.45,45.83)
  Bottom Layer w0.406: v1(30.45,45.83) 30.45,45.58 23.84,38.98 23.84,35.17 28.16,30.85 v1(28.16,30.09)
USART_RX: length 29.9
  Top Layer w0.406: U4.10 27.18,27.29 v1(27.4,27.29) ; U5.1 32.35,43.93 v1(33.24,43.04)
  Bottom Layer w0.406: v1(33.24,43.04) 29.05,43.04 25.24,39.23 25.24,35.04 29.18,31.1 29.18,29.07 v1(27.4,27.29)
USART_TX: length 35.9
  Top Layer w0.406: U5.4 31.81,47.61 v1(34,47.61) ; v1(27.91,26.02) 27.04,26.02 U4.9
  Bottom Layer w0.406: v1(34,47.61) 34.46,47.15 34.46,42.23 34,41.77 29.69,41.77 26.64,38.72 26.64,35.17 29.94,31.86 29.94,28.05 v1(27.91,26.02)
$1N604: length 6.7
  Top Layer w0.508: R2.1 39.06,32.42 U1.5
$1N613: length 11.3
  Top Layer w0.406: v1(43.43,31.36) 42.2,31.36 R2.2 ; Q2.4 v1(51.78,29.56)
  Bottom Layer w0.406: v1(51.78,29.56) 49.98,31.36 v1(43.43,31.36)
$1N618: length 6.6
  Top Layer w0.203: U1.7 36.06,34.96 36.38,35.28 37.94,35.28 38.26,34.96 39.79,34.96 R1.1
$1N628: length 10.6
  Top Layer w0.406: Q1.4 v1(51.78,35.56) ; R1.2 42.39,35.56 v1(43.18,35.56)
  Bottom Layer w0.406: v1(51.78,35.56) v1(43.18,35.56)
$1N817: length 3.3
  Top Layer w0.406: U1.8 37.06,36.23 C1.1
$1N1991: length 6.7
  Top Layer w0.406: R4.1 39.06,20.42 U2.5
$1N1995: length 11.2
  Top Layer w0.406: R4.2 42.77,19.32 v1(43.18,18.91) ; Q4.4 v1(51.78,17.56)
  Bottom Layer w0.406: v1(43.18,18.91) 50.43,18.91 v1(51.78,17.56)
$1N1997: length 6.6
  Top Layer w0.203: R3.1 39.79,22.96 38.26,22.96 37.94,23.28 36.38,23.28 36.06,22.96 U2.7
$1N2001: length 11.3
  Top Layer w0.406: v1(52.04,23.74) 51.09,23.74 Q3.4 ; R3.2 42.58,23.74 v1(43.43,23.74)
  Bottom Layer w0.406: v1(52.04,23.74) v1(43.43,23.74)
$1N2003: length 3.3
  Top Layer w0.406: U2.8 37.06,24.23 C5.1
$1N2429: length 6.7
  Top Layer w0.406: U3.5 39.06,8.42 R6.1
$1N2433: length 11.4
  Top Layer w0.406: R6.2 42.32,7.48 v1(43.18,7.48) ; Q6.4 51.38,5.56 v1(51.78,5.96)
  Bottom Layer w0.406: v1(51.78,5.96) 44.7,5.96 v1(43.18,7.48)
$1N2435: length 6.6
  Top Layer w0.203: U3.7 36.06,10.96 36.38,11.28 37.94,11.28 38.26,10.96 39.79,10.96 R5.1
$1N2439: length 11.5
  Top Layer w0.406: R5.2 42.19,11.29 v1(43.43,11.29) ; v1(52.04,12.05) 51.54,11.56 Q5.4
  Bottom Layer w0.406: v1(52.04,12.05) 51.28,11.29 v1(43.43,11.29)
$1N2441: length 3.3
  Top Layer w0.406: C8.1 37.06,12.23 U3.8
$2N1083: length 19.2
  Top Layer w0.406: 18.19,43.66 18.19,43.78 21.16,46.75 U6.2 25.88,46.75 U5.6
  Top Layer w0.508: 18.19,43.66 11.07,43.66
  Bottom Layer w0.508: R8.1 8.8,43.66 11.07,43.66
$2N1088: length 21.8
  Top Layer w0.406: rs_485_b.1 20.78,41.12 U6.1 25.82,44.85 26.17,45.2
  Top Layer w0.508: 16.44,40.87 18.44,40.87 rs_485_b.1 rs_485_a.1
  Bottom Layer w0.508: R8.2 8.8,41.12 rs_485_a.1
$2N2150: length 3.8
  Top Layer w0.508: 8.93,30.34 12.65,30.34 R9.1
$2N2269: length 3.8
  Top Layer w0.508: R10.1 12.65,34.41 8.93,34.41
$2N2761: length 6.4
  Bottom Layer w0.406: 5V.2 21.84,7.21 3V3.1 21.05,6.99 HALL.1

## Copper pours and planes (outline as drawn; the poured copper is in the pictures)
GND on Top Layer: -2.29,52.19 87.26,52.19 87.26,-10.55 -2.29,-10.55
GND on Bottom Layer: -5.02,63.87 78.28,63.87 78.28,-1.41 -5.02,-1.41

## Text on the board
Top Silkscreen Layer: 1 | 0 | 2 | reset | swdio | swclk | gnd | GND | hall sensor | VCC | B | A | C | H3 | H2 | H1 | ADR | POWER | PHASES
